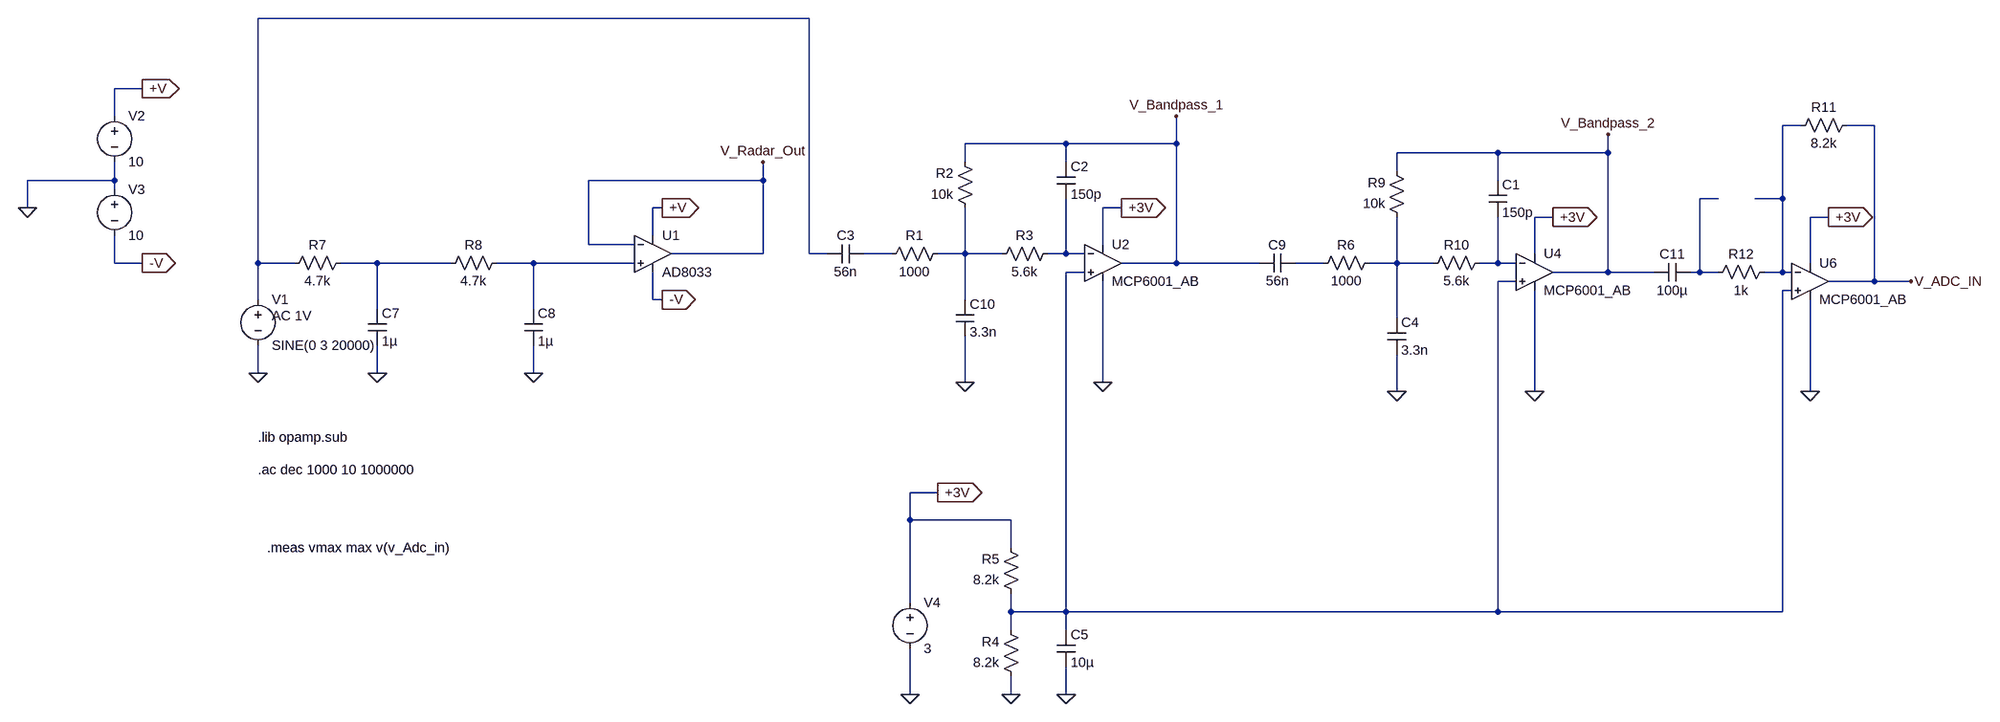
[diagram p0: schematic MF_bandpass.asc]
MF_bandpass.asc, the LTspice schematic file:
Version 4
SHEET 1 2892 680
WIRE 832 -1232 -128 -1232
WIRE -368 -1088 -416 -1088
WIRE -416 -1040 -416 -1088
WIRE 2560 -1024 2528 -1024
WIRE 2688 -1024 2640 -1024
WIRE 1280 -992 1104 -992
WIRE 1472 -992 1472 -1040
WIRE 1472 -992 1280 -992
WIRE 2032 -976 1856 -976
WIRE 2224 -976 2224 -1008
WIRE 2224 -976 2032 -976
WIRE 1104 -960 1104 -992
WIRE 1280 -960 1280 -992
WIRE 1856 -944 1856 -976
WIRE -416 -928 -416 -960
WIRE -416 -928 -576 -928
WIRE 752 -928 752 -960
WIRE 752 -928 448 -928
WIRE 2032 -928 2032 -976
WIRE -416 -912 -416 -928
WIRE 2416 -896 2384 -896
WIRE 2528 -896 2528 -1024
WIRE 2528 -896 2480 -896
WIRE -576 -880 -576 -928
WIRE 576 -880 560 -880
WIRE 1376 -880 1344 -880
WIRE 2128 -864 2096 -864
WIRE 2608 -864 2576 -864
WIRE 560 -832 560 -880
WIRE 448 -816 448 -928
WIRE 528 -816 448 -816
WIRE 1344 -816 1344 -880
WIRE 752 -800 752 -928
WIRE 752 -800 592 -800
WIRE 832 -800 832 -1232
WIRE 864 -800 832 -800
WIRE 976 -800 928 -800
WIRE 1104 -800 1104 -880
WIRE 1104 -800 1056 -800
WIRE 1168 -800 1104 -800
WIRE 1280 -800 1280 -896
WIRE 1280 -800 1248 -800
WIRE 1312 -800 1280 -800
WIRE 2096 -800 2096 -864
WIRE -416 -784 -416 -832
WIRE -368 -784 -416 -784
WIRE -128 -784 -128 -1232
WIRE -64 -784 -128 -784
WIRE 80 -784 16 -784
WIRE 208 -784 80 -784
WIRE 352 -784 288 -784
WIRE 528 -784 352 -784
WIRE 1472 -784 1472 -992
WIRE 1472 -784 1376 -784
WIRE 1616 -784 1472 -784
WIRE 1728 -784 1680 -784
WIRE 1856 -784 1856 -864
WIRE 1856 -784 1808 -784
WIRE 1920 -784 1856 -784
WIRE 2032 -784 2032 -864
WIRE 2032 -784 2000 -784
WIRE 2064 -784 2032 -784
WIRE 2576 -784 2576 -864
WIRE 1312 -768 1280 -768
WIRE 2224 -768 2224 -976
WIRE 2224 -768 2128 -768
WIRE 2304 -768 2224 -768
WIRE 2384 -768 2384 -896
WIRE 2384 -768 2368 -768
WIRE 2416 -768 2384 -768
WIRE 2528 -768 2528 -896
WIRE 2528 -768 2496 -768
WIRE 2544 -768 2528 -768
WIRE 2064 -752 2032 -752
WIRE 2688 -752 2688 -1024
WIRE 2688 -752 2608 -752
WIRE 2752 -752 2688 -752
WIRE 2544 -736 2528 -736
WIRE -128 -720 -128 -784
WIRE 560 -720 560 -768
WIRE 576 -720 560 -720
WIRE 1104 -720 1104 -800
WIRE 80 -704 80 -784
WIRE 352 -704 352 -784
WIRE 1856 -688 1856 -784
WIRE -128 -592 -128 -640
WIRE 80 -592 80 -640
WIRE 352 -592 352 -640
WIRE 1104 -576 1104 -656
WIRE 1344 -576 1344 -752
WIRE 1856 -560 1856 -624
WIRE 2096 -560 2096 -736
WIRE 2576 -560 2576 -720
WIRE 1056 -384 1008 -384
WIRE 1008 -336 1008 -384
WIRE 1184 -336 1008 -336
WIRE 1184 -288 1184 -336
WIRE 1008 -192 1008 -336
WIRE 1184 -176 1184 -208
WIRE 1280 -176 1280 -768
WIRE 1280 -176 1184 -176
WIRE 2032 -176 2032 -752
WIRE 2032 -176 1280 -176
WIRE 2528 -176 2528 -736
WIRE 2528 -176 2032 -176
WIRE 1184 -144 1184 -176
WIRE 1280 -144 1280 -176
WIRE 1008 -32 1008 -112
WIRE 1184 -32 1184 -64
WIRE 1280 -32 1280 -80
FLAG 352 -592 0
FLAG 80 -592 0
FLAG -128 -592 0
FLAG -576 -880 0
FLAG -368 -784 -V
IOPIN -368 -784 Out
FLAG -368 -1088 +V
IOPIN -368 -1088 Out
FLAG 576 -880 +V
IOPIN 576 -880 Out
FLAG 576 -720 -V
IOPIN 576 -720 Out
FLAG 1008 -32 0
FLAG 1056 -384 +3V
IOPIN 1056 -384 Out
FLAG 1344 -576 0
FLAG 1104 -576 0
FLAG 1376 -880 +3V
IOPIN 1376 -880 Out
FLAG 1184 -32 0
FLAG 1280 -32 0
FLAG 2096 -560 0
FLAG 1856 -560 0
FLAG 2128 -864 +3V
IOPIN 2128 -864 Out
FLAG 2608 -864 +3V
IOPIN 2608 -864 Out
FLAG 2576 -560 0
FLAG 752 -960 V_Radar_Out
FLAG 1472 -1040 V_Bandpass_1
FLAG 2224 -1008 V_Bandpass_2
FLAG 2752 -752 V_ADC_IN
SYMBOL res 32 -800 R90
WINDOW 0 0 56 VBottom 2
WINDOW 3 32 56 VTop 2
SYMATTR InstName R7
SYMATTR Value 4.7k
SYMBOL res 304 -800 R90
WINDOW 0 0 56 VBottom 2
WINDOW 3 32 56 VTop 2
SYMATTR InstName R8
SYMATTR Value 4.7k
SYMBOL cap 64 -704 R0
SYMATTR InstName C7
SYMATTR Value 1µ
SYMBOL cap 336 -704 R0
SYMATTR InstName C8
SYMATTR Value 1µ
SYMBOL voltage -128 -736 R0
WINDOW 123 24 44 Left 2
WINDOW 39 0 0 Left 0
SYMATTR Value2 AC 1V
SYMATTR InstName V1
SYMATTR Value SINE(0 3 20000)
SYMBOL OpAmps\\AD8033 560 -864 R0
SYMATTR InstName U1
SYMBOL voltage -416 -1056 R0
WINDOW 123 0 0 Left 0
WINDOW 39 0 0 Left 0
SYMATTR InstName V2
SYMATTR Value 10
SYMBOL voltage -416 -928 R0
WINDOW 123 0 0 Left 0
WINDOW 39 0 0 Left 0
SYMATTR InstName V3
SYMATTR Value 10
SYMBOL voltage 1008 -208 R0
WINDOW 123 0 0 Left 0
WINDOW 39 0 0 Left 0
SYMATTR InstName V4
SYMATTR Value 3
SYMBOL res 1072 -816 R90
WINDOW 0 0 56 VBottom 2
WINDOW 3 32 56 VTop 2
SYMATTR InstName R1
SYMATTR Value 1000
SYMBOL cap 928 -816 R90
WINDOW 0 0 32 VBottom 2
WINDOW 3 32 32 VTop 2
SYMATTR InstName C3
SYMATTR Value 56n
SYMBOL res 1200 -48 R180
WINDOW 0 36 76 Left 2
WINDOW 3 36 40 Left 2
SYMATTR InstName R4
SYMATTR Value 8.2k
SYMBOL res 1200 -192 R180
WINDOW 0 36 76 Left 2
WINDOW 3 36 40 Left 2
SYMATTR InstName R5
SYMATTR Value 8.2k
SYMBOL cap 1264 -144 R0
SYMATTR InstName C5
SYMATTR Value 10µ
SYMBOL res 1824 -800 R90
WINDOW 0 0 56 VBottom 2
WINDOW 3 32 56 VTop 2
SYMATTR InstName R6
SYMATTR Value 1000
SYMBOL cap 1680 -800 R90
WINDOW 0 0 32 VBottom 2
WINDOW 3 32 32 VTop 2
SYMATTR InstName C9
SYMATTR Value 56n
SYMBOL res 2656 -1040 R90
WINDOW 0 0 56 VBottom 2
WINDOW 3 32 56 VTop 2
SYMATTR InstName R11
SYMATTR Value 8.2k
SYMBOL res 2512 -784 R90
WINDOW 0 0 56 VBottom 2
WINDOW 3 32 56 VTop 2
SYMATTR InstName R12
SYMATTR Value 1k
SYMBOL cap 2368 -784 R90
WINDOW 0 0 32 VBottom 2
WINDOW 3 32 32 VTop 2
SYMATTR InstName C11
SYMATTR Value 100µ
SYMBOL MCP6001_AB 1344 -848 R0
SYMATTR InstName U2
SYMBOL MCP6001_AB 2096 -832 R0
SYMATTR InstName U4
SYMBOL MCP6001_AB 2576 -816 R0
SYMATTR InstName U6
SYMBOL cap 1264 -960 R0
SYMATTR InstName C2
SYMATTR Value 150p
SYMBOL res 1264 -816 R90
WINDOW 0 0 56 VBottom 2
WINDOW 3 32 56 VTop 2
SYMATTR InstName R3
SYMATTR Value 5.6k
SYMBOL cap 1088 -720 R0
SYMATTR InstName C10
SYMATTR Value 3.3n
SYMBOL res 1120 -864 R180
WINDOW 0 36 76 Left 2
WINDOW 3 36 40 Left 2
SYMATTR InstName R2
SYMATTR Value 10k
SYMBOL res 1872 -848 R180
WINDOW 0 36 76 Left 2
WINDOW 3 36 40 Left 2
SYMATTR InstName R9
SYMATTR Value 10k
SYMBOL res 2016 -800 R90
WINDOW 0 0 56 VBottom 2
WINDOW 3 32 56 VTop 2
SYMATTR InstName R10
SYMATTR Value 5.6k
SYMBOL cap 2016 -928 R0
SYMATTR InstName C1
SYMATTR Value 150p
SYMBOL cap 1840 -688 R0
SYMATTR InstName C4
SYMATTR Value 3.3n
TEXT -128 -480 Left 2 !.lib opamp.sub
TEXT -128 -424 Left 2 !.ac dec 1000 10 1000000
TEXT -112 -288 Left 2 !.meas vmax max v(v_Adc_in)

The netlist it stands for:
* MF_bandpass.asc
R7 N007 N001 4.7k
R8 N008 N007 4.7k
C7 N007 0 1µ
C8 N008 0 1µ
V1 N001 0 SINE(0 3 20000) AC 1V
XU1 N008 V_Radar_Out +V -V V_Radar_Out AD8033  ; pins In+ In- V+ V- OUT
V2 +V 0 10
V3 0 -V 10
V4 +3V 0 3
R1 N005 N004 1000
C3 N004 N001 56n
R4 0 N012 8.2k
R5 N012 +3V 8.2k
C5 N012 0 10µ
R6 N010 N009 1000
C9 N009 V_Bandpass_1 56n
R11 V_ADC_IN N002 8.2k
R12 N002 N003 1k
C11 N003 V_Bandpass_2 100µ
* U2: MCP6001_AB (symbol MCP6001_AB not available, pins judged from their places): In+=N012 In-=N006 V+=+3V V-=0 OUT=V_Bandpass_1
* U4: MCP6001_AB (symbol MCP6001_AB not available, pins judged from their places): In+=N012 In-=N011 V+=+3V V-=0 OUT=V_Bandpass_2
* U6: MCP6001_AB (symbol MCP6001_AB not available, pins judged from their places): In+=N012 In-=N002 V+=+3V V-=0 OUT=V_ADC_IN
C2 V_Bandpass_1 N006 150p
R3 N006 N005 5.6k
C10 N005 0 3.3n
R2 N005 V_Bandpass_1 10k
R9 N010 V_Bandpass_2 10k
R10 N011 N010 5.6k
C1 V_Bandpass_2 N011 150p
C4 N010 0 3.3n
.lib opamp.sub
.ac dec 1000 10 1000000
.meas vmax max v(v_Adc_in)
.backanno
.end